# Altium project BABYCAR_PROJ.PrjPcb
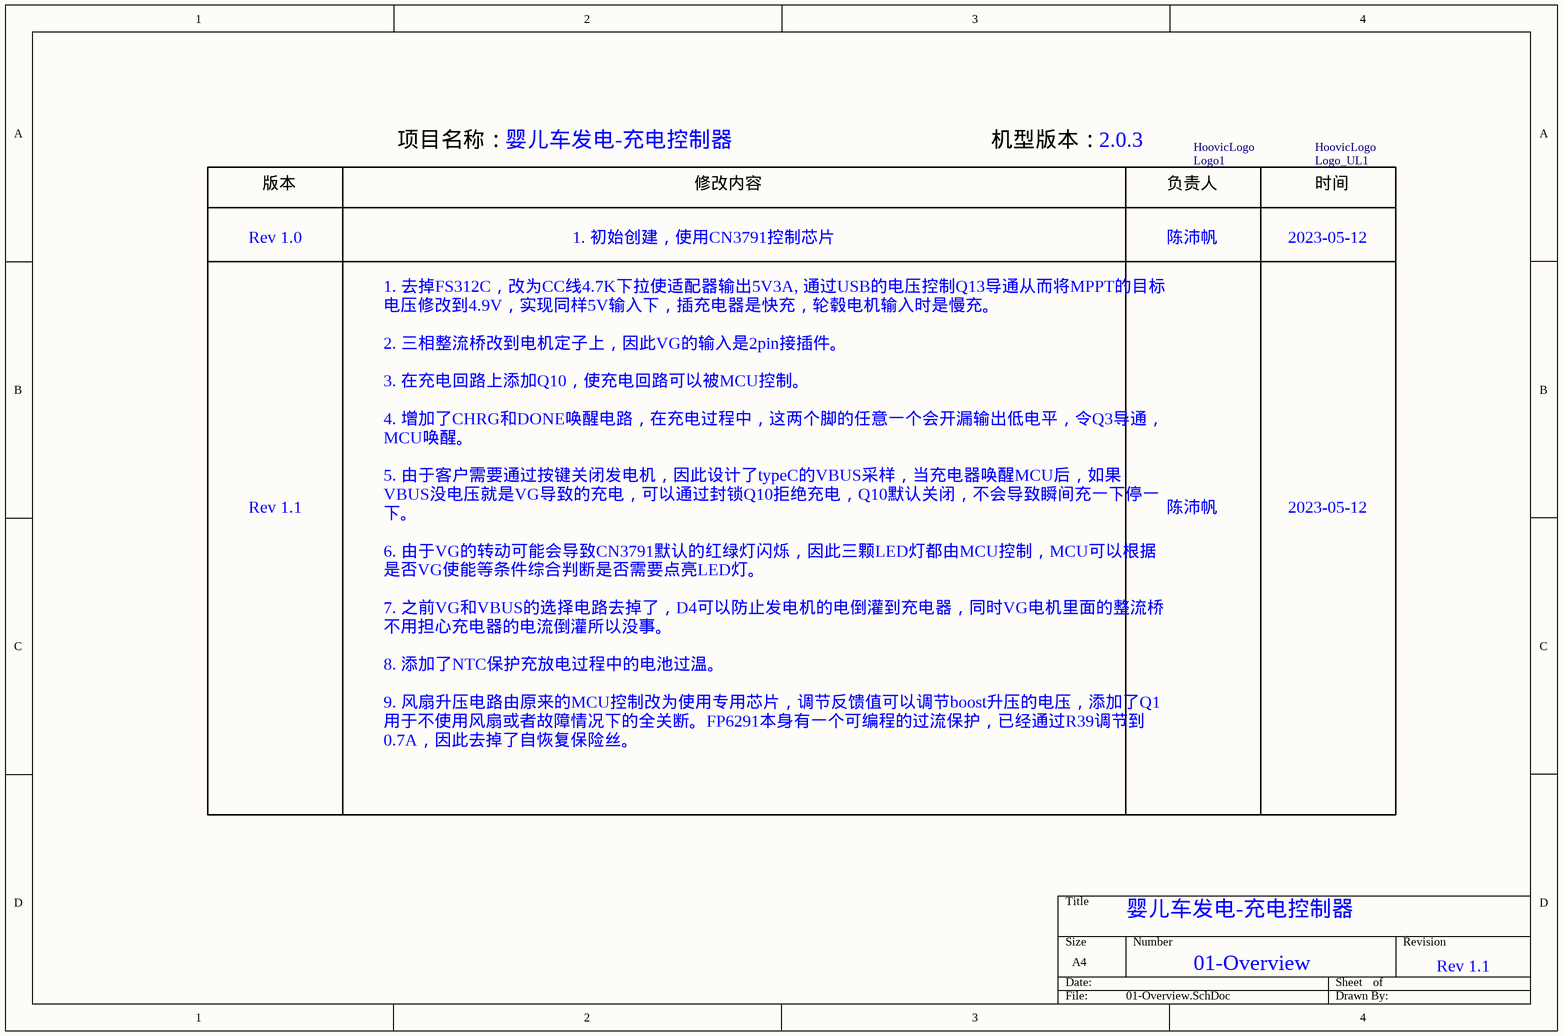
[diagram p0: 01-Overview.SchDoc]
3 sheets, 118 parts. Net scope: global (net labels, ports and power ports of the same name join across sheets).
Board file: 80-BabyCarBatControl_PCB.PcbDoc
Sheets:
  01-Overview.SchDoc
  02-ChargeControl.SchDoc
  03-DC_DC.SchDoc

## Sheet 01-Overview.SchDoc
size A4

### Parts
Logo1  Logo  [HoovicLogo_8mm]  (value not drawn)
Logo_UL1  Logo  [UL_LOGO_3MM]  (value not drawn)

### Notes on the sheet
- 项目名称：
- 婴儿车发电-充电控制器
- 机型版本：
- 2.0.3
- Rev 1.0
- 版本
- 1. 初始创建，使用CN3791控制芯片
- 修改内容
- (near Logo1) 负责人
- 陈沛帆
- 2023-05-12
- (near Logo_UL1) 时间
- Rev 1.1
- 1. 去掉FS312C，改为CC线4.7K下拉使适配器输出5V3A, 通过USB的电压控制Q13导通从而将MPPT的目标电压修改到4.9V，实现同样5V输入下，插充电器是快充，轮毂电机输入时是慢充。
  2. 三相整流桥改到电机定子上，因此VG的输入是2pin接插件。
  3. 在充电回路上添加Q10，使充电回路可以被MCU控制。
  4. 增加了CHRG和DONE唤醒电路，在充电过程中，这两个脚的任意一个会开漏输出低电平，令Q3导通，MCU唤醒。
  5. 由于客户需要通过按键关闭发电机，因此设计了typeC的VBUS采样，当充电器唤醒MCU后，如果VBUS没电压就是VG导致的充电，可以通过封锁Q10拒绝充电，Q10默认关闭，不会导致瞬间充一下停一下。
  6. 由于VG的转动可能会导致CN3791默认的红绿灯闪烁，因此三颗LED灯都由MCU控制，MCU可以根据是否VG使能等条件综合判断是否需要点亮LED灯。
  7. 之前VG和VBUS的选择电路去掉了，D4可以防止发电机的电倒灌到充电器，同时VG电机里面的整流桥不用担心充电器的电流倒灌所以没事。
  8. 添加了NTC保护充放电过程中的电池过温。
  9. 风扇升压电路由原来的MCU控制改为使用专用芯片，调节反馈值可以调节boost升压的电压，添加了Q1用于不使用风扇或者故障情况下的全关断。FP6291本身有一个可编程的过流保护，已经通过R39调节到0.7A，因此去掉了自恢复保险丝。
- 01-Overview
- (in symbol Logo) HoovicLogo

## Sheet 02-ChargeControl.SchDoc
size A3
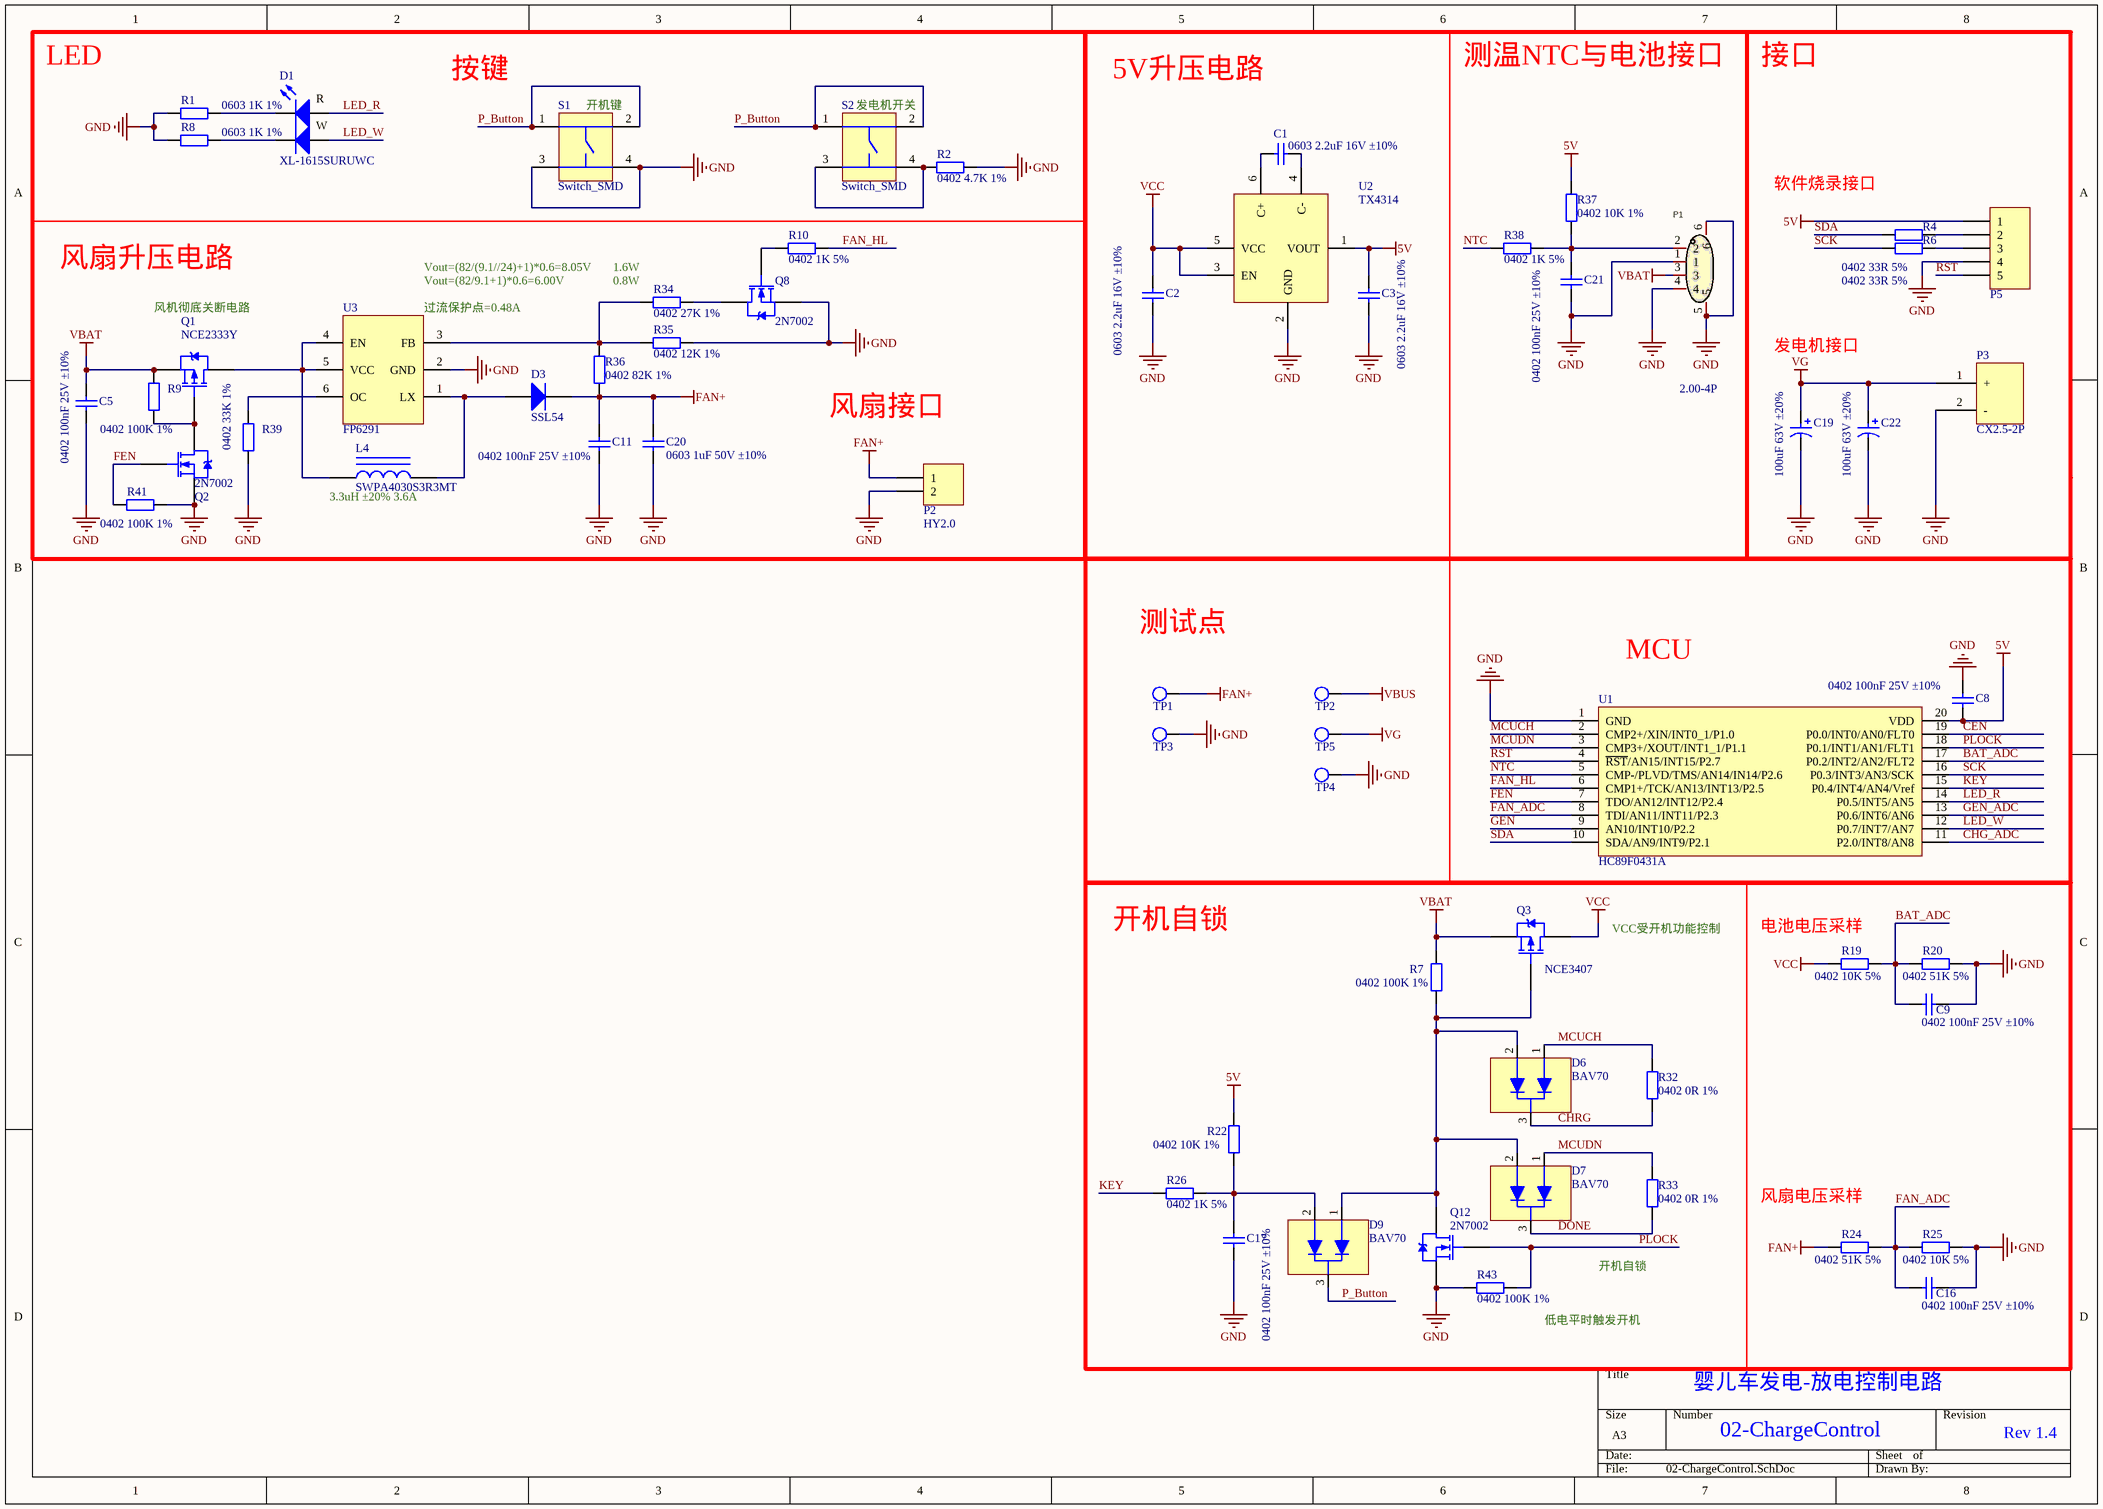
[diagram p1: 02-ChargeControl.SchDoc]

### Parts
C1  0603 2.2uF 16V ±10%  [C0603]
C2  0603 2.2uF 16V ±10%  [C0603]
C3  0603 2.2uF 16V ±10%  [C0603]
C5  0402 100nF 25V ±10%  [C0402]
C8  0402 100nF 25V ±10%  [C0402]
C9  0402 100nF 25V ±10%  [C0402]
C11  0402 100nF 25V ±10%  [C0402]
C16  0402 100nF 25V ±10%  [C0402]
C17  0402 100nF 25V ±10%  [C0402]
C19  100uF 63V ±20%  [CAP-TH_BD8-P3.50-D1.0-WD]
C20  0603 1uF 50V ±10%  [C0603]
C21  0402 100nF 25V ±10%  [C0402]
C22  100uF 63V ±20%  [CAP-TH_BD8-P3.50-D1.0-WD]
D1  XL-1615SURUWC  [LED-SMD_4P-L1.6-W1.5-RD_XL-1615SURUWC]
D3  SSL54  [SMB]
D6  BAV70  [SOT-23-3]
D7  BAV70  [SOT-23-3]
D9  BAV70  [SOT-23-3]
L4  SWPA4030S3R3MT  [IND-SMD_L4.0-W4.0_SMNR4012]
P1  2.00-4P  [CONN-SMD_4P-P2.00]
P2  HY2.0  [CONN-SMD_HY2.0-2P]
P3  CX2.5-2P  [CX2.5-2P]
P5  Header 5  [CONN-TH_5P-2.54-DIR]  (value not drawn)
Q1  NCE2333Y  [SOT-23-3-MOSFET]
Q2  2N7002  [SOT-23-3-MOSFET]
Q3  NCE3407  [SOT-23-3-MOSFET]
Q8  2N7002  [SOT-23-3-MOSFET]
Q12  2N7002  [SOT-23-3-MOSFET]
R1  0603 1K 1%  [R0603]
R2  0402 4.7K 1%  [R0402]
R4  0402 33R 5%  [R0402]
R6  0402 33R 5%  [R0402]
R7  0402 100K 1%  [R0402]
R8  0603 1K 1%  [R0603]
R9  0402 100K 1%  [R0402]
R10  0402 1K 5%  [R0402]
R19  0402 10K 5%  [R0402]
R20  0402 51K 5%  [R0402]
R22  0402 10K 1%  [R0402]
R24  0402 51K 5%  [R0402]
R25  0402 10K 5%  [R0402]
R26  0402 1K 5%  [R0402]
R32  0402 0R 1%  [R0402]
R33  0402 0R 1%  [R0402]
R34  0402 27K 1%  [R0402]
R35  0402 12K 1%  [R0402]
R36  0402 82K 1%  [R0402]
R37  0402 10K 1%  [R0402]
R38  0402 1K 5%  [R0402]
R39  0402 33K 1%  [R0402]
R41  0402 100K 1%  [R0402]
R43  0402 100K 1%  [R0402]
S1  Switch_SMD  [SMD-4_6x6]
S2  Switch_SMD  [SMD-4_6x6]
TP1  TestPoint  [TESTPOINT-70MIL]  (value not drawn)
TP2  TestPoint  [TESTPOINT-70MIL]  (value not drawn)
TP3  TestPoint  [TESTPOINT-70MIL]  (value not drawn)
TP4  TestPoint  [TESTPOINT-70MIL]  (value not drawn)
TP5  TestPoint  [TESTPOINT-70MIL]  (value not drawn)
U1  HC89F0431A  [TSSOP-20]
U2  TX4314  [SOT-23-6]
U3  FP6291  [SOT-23-6]

### Blocks framed on the sheet
开机自锁: C9 C16 C17 D6 D7 D9 Q3 Q12 R7 R19 R20 R22 R24-R26 R32 R33 R43

### Nets
5V: C3.2 C8.1 P5.1 R22.1 R37.2 U1.20(VDD) U2.1(VOUT)
FAN+: C11.2 C20.2 D3.1(K) P2.1 R24.1 R36.1 TP1.1
GND: C2.1 C3.1 C5.1 C8.2 C9.1 C11.1 C16.1 C17.1 C19.2 C20.1 C21.1 C22.2 P1.1 P1.4 P1.5 P1.6 P2.2 P3.2(-) P5.4 Q2.3(S) Q8.3(S) Q12.3(S) R1.2 R2.2 R8.2 R20.2 R25.2 R35.1 R39.2 R41.2 R43.2 S1.3 S1.4 TP3.1 TP4.1 U1.1(GND) U2.2(GND) U3.2(GND)
VBAT: C5.2 P1.3 Q1.3(S) Q3.3(S) R7.1 R9.1
VBUS: TP2.1
VCC: C2.2 Q3.2(D) R19.1 U2.3(EN) U2.5(VCC)
VG: C19.1 C22.1 P3.1(+) TP5.1
BAT_ADC: C9.2 R19.2 R20.1 U1.17(P0.2/INT2/AN2/FLT2)
CEN: U1.19(P0.0/INT0/AN0/FLT0)
CHG_ADC: U1.11(P2.0/INT8/AN8)
CHRG: D6.3(K) R32.1
DONE: D7.3(K) R33.1
FAN_ADC: C16.2 R24.2 R25.1 U1.8(TDI/AN11/INT11/P2.3)
FAN_HL: R10.1 U1.6(CMP1+/TCK/AN13/INT13/P2.5)
FEN: Q2.1(G) R41.1 U1.7(TDO/AN12/INT12/P2.4)
GEN: U1.9(AN10/INT10/P2.2)
GEN_ADC: U1.13(P0.6/INT6/AN6)
KEY: R26.2 U1.15(P0.4/INT4/AN4/Vref)
LED_R: D1.2(+) U1.14(P0.5/INT5/AN5)
LED_W: D1.4(+) U1.12(P0.7/INT7/AN7)
MCUCH: D6.1(A1) R32.2 U1.2(CMP2+/XIN/INT0_1/P1.0)
MCUDN: D7.1(A1) R33.2 U1.3(CMP3+/XOUT/INT1_1/P1.1)
NTC: R38.1 U1.5(CMP-/PLVD/TMS/AN14/IN14/P2.6)
P_Button: D9.3(K) S1.1 S1.2 S2.1 S2.2
PLOCK: Q12.1(G) R43.1 U1.18(P0.1/INT1/AN1/FLT1)
RST: P5.5 U1.4(~{RST}/AN15/INT15/P2.7)
SCK: R6.1 U1.16(P0.3/INT3/AN3/SCK)
SDA: R4.1 U1.10(SDA/AN9/INT9/P2.1)
NetC1_1: C1.1 U2.4(C-)
NetC1_2: C1.2 U2.6(C+)
NetC17_2: C17.2 D9.2(A2) R22.2 R26.1
NetC21_2: C21.2 P1.2 R37.1 R38.2
NetD1_1: D1.1(-) R1.1
NetD1_3: D1.3(-) R8.1
NetD3_2: D3.2(A) L4.2 U3.1(LX)
NetD6_2: D6.2(A2) D7.2(A2) D9.1(A1) Q3.1(G) Q12.2(D) R7.2
NetL4_1: L4.1 Q1.2(D) U3.4(EN) U3.5(VCC)
NetP5_2: P5.2 R4.2
NetP5_3: P5.3 R6.2
NetQ1_1: Q1.1(G) Q2.2(D) R9.2
NetQ8_1: Q8.1(G) R10.2
NetQ8_2: Q8.2(D) R34.1
NetR2_1: R2.1 S2.3 S2.4
NetR34_2: R34.2 R35.2 R36.2 U3.3(FB)
NetR39_1: R39.1 U3.6(OC)

### Notes on the sheet
- LED
- 按键
- (near S1) 开机键
- (near S2) 发电机开关
- 5V升压电路
- 测温NTC与电池接口
- 接口
- 软件烧录接口
- 风扇升压电路
- 风机彻底关断电路
- (near U3) 过流保护点=0.48A
- Vout=(82/(9.1//24)+1)*0.6=8.05V
- Vout=(82/9.1+1)*0.6=6.00V
- (near R34) 1.6W
- (near R34) 0.8W
- 发电机接口
- 风扇接口
- (near L4) 3.3uH ±20% 3.6A
- 测试点
- MCU
- VCC受开机功能控制
- (near R19) 电池电压采样
- (near R24) 风扇电压采样
- (near R43) 低电平时触发开机
- 开机自锁
- 婴儿车发电-放电控制电路
- 02-ChargeControl
- Rev 1.4
- (in symbol XL-1615SURUWC) R; W

### Library data of the parts
C1-C3 C20 = Cap_0603: 贴片电容
C5 C8 C9 C11 C16 C17 C21 = Cap_0402: 贴片电容
C19 C22 = Cap_elec: 电解电容
D1 = XL-1615SURUWC: 0603封装的红白黄色LED
D3 = SS36B: 贴片肖特基二极管
L4 = Inductor Iron: 功率电感
P1 = 2.00-4PWTDK: 连接器4pin，2.00间距; Manufacturer: SHOU HAN(首韩); Name: 1.25-4PWTDK; Add into BOM: yes; Pitch: 1.25mm; Pins Structure: 1x4P; Number of PINs Per Row: 4; Gender: 公型插针; Current Rating (Max): 1A; Symbol: 1.25-4PWTDK; Device: 1.25-4PWTDK; LCSC Part Name: 1.25间距 4P卧贴 带扣; Supplier Part: C3008554; Manufacturer Part: 1.25-4PWTDK; Supplier Footprint: SMD,P=1.25mm; JLCPCB Part Class: Extended Part; Datasheet: https://atta.szlcsc.com/upload/public/pdf/source/20220427/006CB3E3578F619E540A50F8B0C3F638.pdf; Supplier: LCSC; Convert to PCB: yes; Number of Rows: 1; Mounting Style: 卧贴; Operating Temperature Range: -25℃~+85℃
P2 = Header 2: 连接器, 2-Pin
P3 = CX2.5-2P: 磁吸端子 弯插 2pin 2.5针距
P5 = Header 5: 连接器, 5-Pin
Q1 Q3 = NCE2309: P-MOSFET with 3 Pin Vdss=60V Id=1.6A Vgs(th)=2V
Q2 Q8 Q12 = 2N7002: N-MOSFET with 3 Pin Vdss=60V  Id=115mA Vgs(th)=2.5V
R1 R8 = Res_0603: 贴片电阻
R2 R4 R6 R7 R9 R10 R19 R20 R22 R24-R26 R32-R39 R41 R43 = Res_0402: 贴片电阻
S1 S2 = Switch_SMD_4P: 4PIN按键开关
TP1-TP5 = TP: 测试点
U1 = HC89F0431A: 芯圣HC89F0431A
U2 = TX4314: DC-DC升压电荷泵
U3 = FP6291: DC-DC升压控制芯片

## Sheet 03-DC_DC.SchDoc
size A3
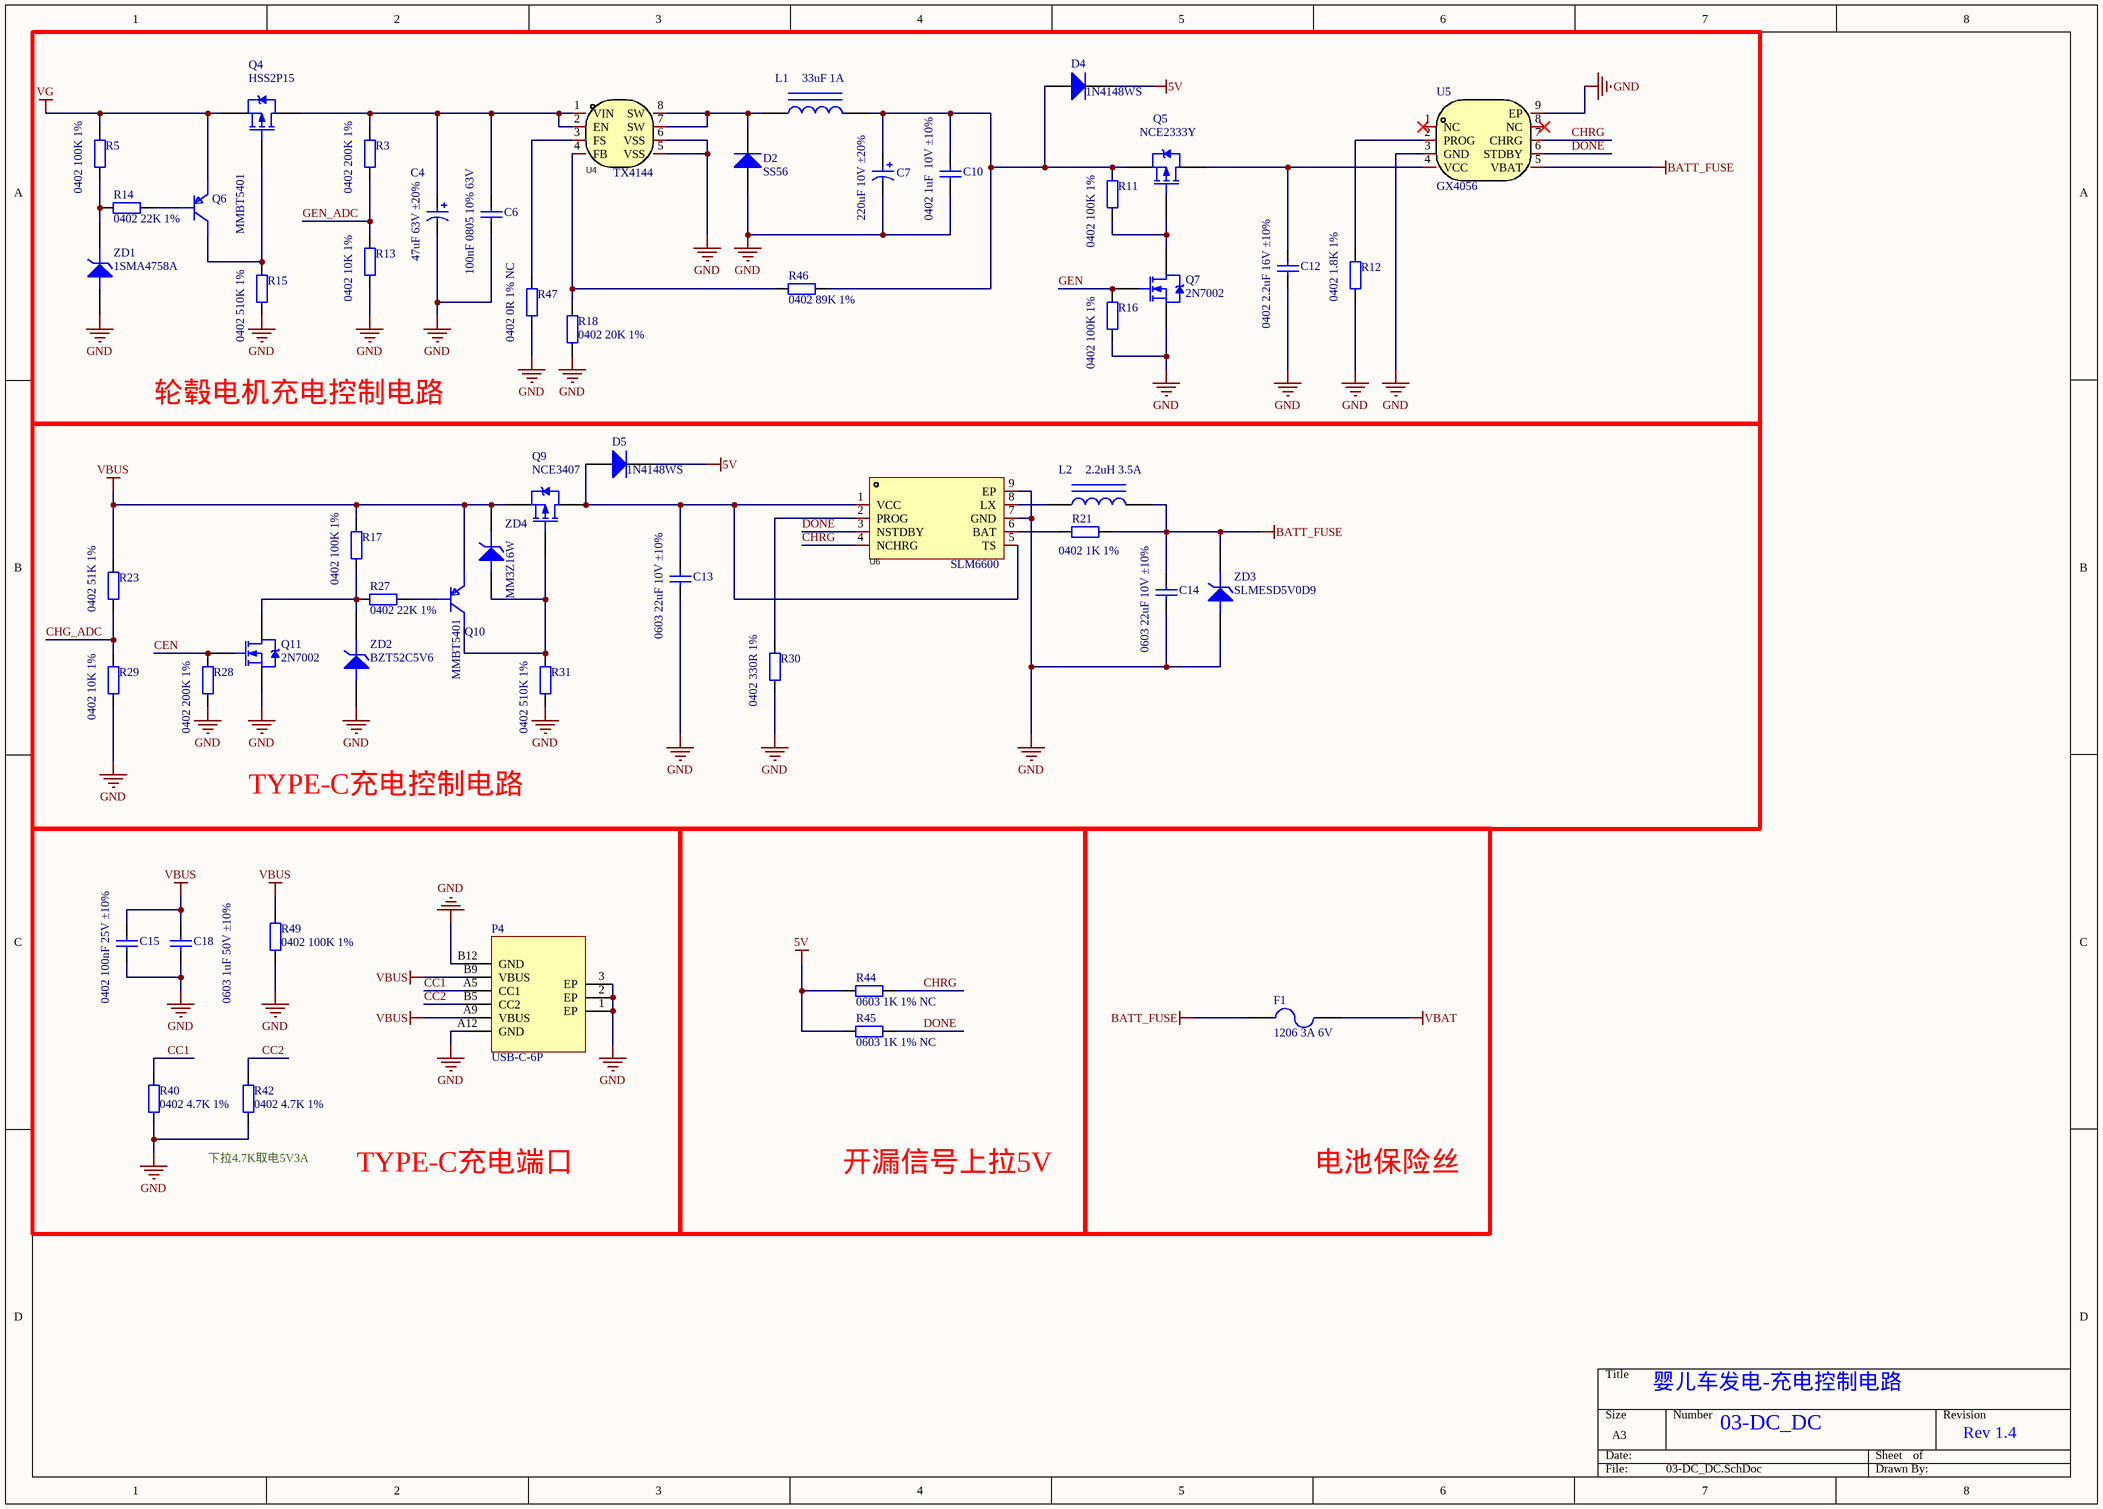
[diagram p2: 03-DC_DC.SchDoc]

### Parts
C4  47uF 63V ±20%  [CAP-TH_BD6.3-P2.50-D1.0-WD]
C6  100nF 0805 10% 63V  [0805_C]
C7  220uF 10V ±20%  [CAP-SMD_BD6.3-L6.6-W6.6-LS7.4-FD]
C10  0402 1uF  10V ±10%  [C0402]
C12  0402 2.2uF 16V ±10%  [C0402]
C13  0603 22uF 10V ±10%  [C0603]
C14  0603 22uF 10V ±10%  [C0603]
C15  0402 100nF 25V ±10%  [C0402]
C18  0603 1uF 50V ±10%  [C0603]
D2  SS56  [SMB]
D4  1N4148WS  [SOD-323F_L2.0-W1.6-LS2.5-RD]
D5  1N4148WS  [SOD-323F_L2.0-W1.6-LS2.5-RD]
F1  1206 3A 6V  [F1206]
L1  33uF 1A  [IND-SMD_L7.1-W6.6]
L2  2.2uH 3.5A  [IND2520]
P4  USB-C-6P  [USB-C-SMD_KH-TYPE-C-6P -L]
Q4  HSS2P15  [SOT-23-3-MOSFET]
Q5  NCE2333Y  [SOT-23-3-MOSFET]
Q6  MMBT5401  [SOT-23-3]
Q7  2N7002  [SOT-23-3-MOSFET]
Q9  NCE3407  [SOT-23-3-MOSFET]
Q10  MMBT5401  [SOT-23-3]
Q11  2N7002  [SOT-23-3-MOSFET]
R3  0402 200K 1%  [R0402]
R5  0402 100K 1%  [R0402]
R11  0402 100K 1%  [R0402]
R12  0402 1.8K 1%  [R0402]
R13  0402 10K 1%  [R0402]
R14  0402 22K 1%  [R0402]
R15  0402 510K 1%  [R0402]
R16  0402 100K 1%  [R0402]
R17  0402 100K 1%  [R0402]
R18  0402 20K 1%  [R0402]
R21  0402 1K 1%  [R0402]
R23  0402 51K 1%  [R0402]
R27  0402 22K 1%  [R0402]
R28  0402 200K 1%  [R0402]
R29  0402 10K 1%  [R0402]
R30  0402 330R 1%  [R0402]
R31  0402 510K 1%  [R0402]
R40  0402 4.7K 1%  [R0402]
R42  0402 4.7K 1%  [R0402]
R44  0603 1K 1% NC  [R0603]
R45  0603 1K 1% NC  [R0603]
R46  0402 89K 1%  [R0402]
R47  0402 0R 1% NC  [R0402]
R49  0402 100K 1%  [R0402]
U4  TX4144  [SOP-8_150mil]
U5  GX4056  [SOP-8-EP]
U6  SLM6600  [SOP-8_L4.9-W3.9-P1.27-LS6.0-BL-EP]
ZD1  1SMA4758A  [SMA]
ZD2  BZT52C5V6  [SOD-123]
ZD3  SLMESD5V0D9  [SOD-123]
ZD4  MM3Z16W  [SOD-323F_L2.0-W1.6-LS2.5-RD]

### Blocks framed on the sheet
TYPE-C充电端口: C15 C18 P4 R40 R42 R49
开漏信号上拉5V: R44 R45
电池保险丝: F1

### Nets
5V: D4.1(K) D5.1(K) R44.1 R45.1
BATT_FUSE: C14.2 F1.1 L2.2 R21.2 U5.5(VBAT) ZD3.1(K)
GND: C4.2 C6.1 C7.2 C10.1 C12.2 C13.1 C14.1 C15.2 C18.1 D2.2(A) P4.1(EP) P4.2(EP) P4.3(EP) P4.A12(GND) P4.B12(GND) Q7.3(S) Q11.3(S) R12.1 R13.2 R15.1 R16.1 R18.1 R28.1 R29.2 R30.2 R31.1 R40.2 R42.2 R47.1 R49.2 U4.5(VSS) U4.6(VSS) U5.3(GND) U5.9(EP) U6.7(GND) U6.9(EP) ZD1.2(A) ZD2.2(A) ZD3.2(A)
VBAT: F1.2
VBUS: C15.1 C18.2 P4.A9(VBUS) P4.B9(VBUS) Q9.3(S) Q10.2(E) R17.2 R23.2 R49.1 ZD4.1(K)
VG: Q4.3(S) Q6.2(E) R5.2
CC1: P4.A5(CC1) R40.1
CC2: P4.B5(CC2) R42.1
CEN: Q11.1(G) R28.2
CHG_ADC: R23.1 R29.1
CHRG: R44.2 U5.7(CHRG) U6.4(NCHRG)
DONE: R45.2 U5.6(STDBY) U6.3(NSTDBY)
GEN: Q7.1(G) R16.2
GEN_ADC: R3.1 R13.1
NetC4_1: C4.1 C6.2 Q4.2(D) R3.2 U4.1(VIN) U4.2(EN)
NetC7_1: C7.1 C10.2 D4.2(A) L1.2 Q5.3(S) R11.2 R46.2
NetC12_1: C12.1 Q5.2(D) U5.4(VCC)
NetC13_2: C13.2 D5.2(A) Q9.2(D) U6.1(VCC) U6.5(TS)
NetD2_1: D2.1(K) L1.1 U4.7(SW) U4.8(SW)
NetL2_1: L2.1 U6.8(LX)
NetQ4_1: Q4.1(G) Q6.3(C) R15.2
NetQ5_1: Q5.1(G) Q7.2(D) R11.1
NetQ6_1: Q6.1(B) R14.1
NetQ9_1: Q9.1(G) Q10.3(C) R31.2 ZD4.2(A)
NetQ10_1: Q10.1(B) R27.1
NetQ11_2: Q11.2(D) R17.1 R27.2 ZD2.1(K)
NetR5_1: R5.1 R14.2 ZD1.1(K)
NetR12_2: R12.2 U5.2(PROG)
NetR18_2: R18.2 R46.1 U4.4(FB)
NetR21_1: R21.1 U6.6(BAT)
NetR30_1: R30.1 U6.2(PROG)
NetR47_2: R47.2 U4.3(FS)

Not connected (* = marked no-connect by the designer): U5 1(NC)* 8(NC)*

### Notes on the sheet
- 轮毂电机充电控制电路
- TYPE-C充电控制电路
- (near R42) 下拉4.7K取电5V3A
- 婴儿车发电-充电控制电路
- 03-DC_DC
- Rev 1.4

### Library data of the parts
C4 C7 = Cap_elec: 电解电容
C6 = 0805 100nF(104) 10% 50V: 贴片电容; ComponentLink1Description: 供应商链接; ComponentLink1URL: http://www.szlcsc.com/product/details_50686.html; Package: 0805; Supplier: LC; SuppliersPartNumber: C49678
C10 C15 = Cap_0402: 贴片电容
C12-C14 C18 = Cap_0603: 贴片电容
D2 = SS56B: 贴片肖特基二极管
D4 D5 = 1N4148WS: 贴片普通二极管 Vr=100V Io=150mA Vf=1.25V
F1 = Fuse: 保险丝/熔断器
L1 L2 = Inductor Iron: 功率电感
P4 = USB-C-6P_: 6Pin USB Type-C 接口
Q4 Q5 Q9 = NCE2309: as Q1 on sheet 02-ChargeControl
Q6 Q10 = MMBT5401: PNP三极管
Q7 Q11 = 2N7002: as Q2 on sheet 02-ChargeControl
R3 R5 R11 R12 R14-R18 R21 R27 R28 R30 R31 R40 R42 R46 R47 R49 = Res_0402: 贴片电阻
R13 R23 R29 R44 R45 = Res_0603: 贴片电阻
U4 = TX4144: 降压型 输入6V~60V 1.5A; Manufacturer: XDS(芯鼎盛); Add into BOM: yes; Number of Outputs: 1; Input Voltage: 6V~0V; Switching Frequency: 140kHz；450kHz; Quiescent Current (Iq): 150uA; Name: TX4144; Symbol: TX4144; Device: TX4144; LCSC Part Name: 降压型 Vin=6V~0V 1.5A; Supplier Part: C4153685; Manufacturer Part: TX4144; Supplier Footprint: SOP-8; JLCPCB Part Class: Extended Part; Datasheet: https://atta.szlcsc.com/upload/public/pdf/source/20220706/F01FB6E18B2A790E98A19A1C52DE2D08.pdf; Supplier: LCSC; Convert to PCB: yes; Function: 降压型; Synchronous Rectification: -; Output Type: -; Topology: -; Output Voltage: -; Output Current (Max): 1.5A; Operating Temperature: -40℃~+85℃@(Ta)
U5 = GX4056: 1000mA 锂电池充电器芯片; Manufacturer: 国芯佳品; Add into BOM: yes; Maximum Charge Current: 1A; Name: GX4056; Symbol: GX4056; Device: GX4056; LCSC Part Name: GX4056; Supplier Part: C5259236; Manufacturer Part: GX4056; Supplier Footprint: SOP-8-EP; JLCPCB Part Class: Extended Part; Datasheet: https://atta.szlcsc.com/upload/public/pdf/source/20221111/1186739FA5174D5673D9C2FF440403FD.pdf; Supplier: LCSC; Convert to PCB: yes
U6 = SLM6600: 锂电池管理; Manufacturer: 无锡松朗微; Add into BOM: yes; Name: SLM6600; Symbol: SLM6600; Device: SLM6600; LCSC Part Name: SLM6600; Supplier Part: C130316; Manufacturer Part: SLM6600; Supplier Footprint: SOP-8-EP-150mil; JLCPCB Part Class: Extended Part; Datasheet: https://atta.szlcsc.com/upload/public/pdf/source/20200723/C130316_33CFDDBAEF8892C90734B89DFA84F834.pdf; Supplier: LCSC; Convert to PCB: yes
ZD1-ZD4 = ZENER/TVS: 稳压管/单向TVS管
  ZD1: link: https://item.szlcsc.com/436890.html

## Nets that join several sheets
5V: 02-ChargeControl (7 pins), 03-DC_DC (D4.1 D5.1 R44.1 R45.1)
GND: 02-ChargeControl (38 pins), 03-DC_DC (39 pins)
VBAT: 02-ChargeControl (6 pins), 03-DC_DC (F1.2)
VBUS: 02-ChargeControl (TP2.1), 03-DC_DC (10 pins)
VG: 02-ChargeControl (C19.1 C22.1 P3.1 TP5.1), 03-DC_DC (Q4.3 Q6.2 R5.2)
CEN: 02-ChargeControl (U1.19), 03-DC_DC (Q11.1 R28.2)
CHG_ADC: 02-ChargeControl (U1.11), 03-DC_DC (R23.1 R29.1)
CHRG: 02-ChargeControl (D6.3 R32.1), 03-DC_DC (R44.2 U5.7 U6.4)
DONE: 02-ChargeControl (D7.3 R33.1), 03-DC_DC (R45.2 U5.6 U6.3)
GEN: 02-ChargeControl (U1.9), 03-DC_DC (Q7.1 R16.2)
GEN_ADC: 02-ChargeControl (U1.13), 03-DC_DC (R3.1 R13.1)